# Altium project CH9329.PrjPcb
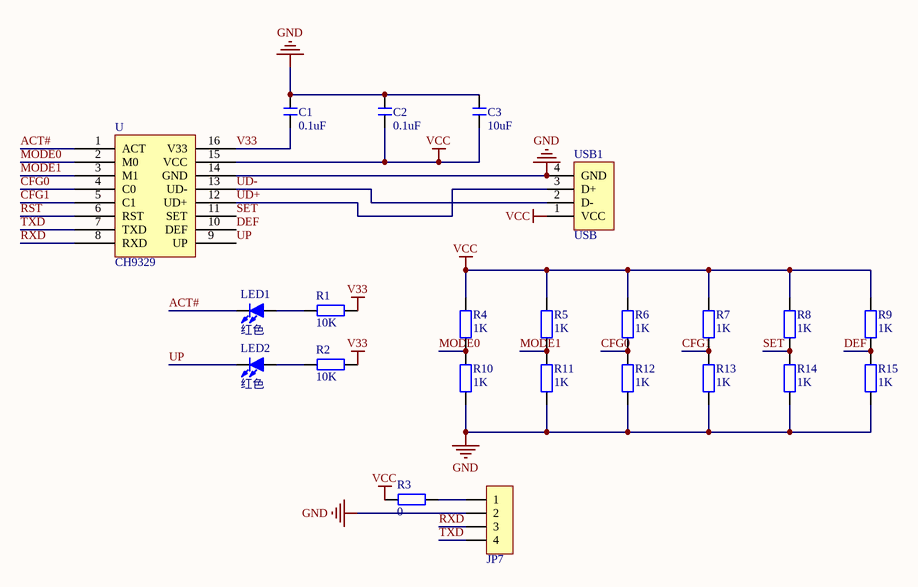
[diagram p0: CH9329.SchDoc]
1 sheet, 23 parts. Net scope: global (net labels, ports and power ports of the same name join across sheets).
Board file: CH9329.PcbDoc

## Sheet CH9329.SchDoc
size A4

### Parts
C1  0.1uF  [C 0805_L]
C2  0.1uF  [C 0805_L]
C3  10uF  [C 0805_L]
JP7  HDR-1X4  [HDR2.54-LI-4P]  (value not drawn)
LED1  红色  [LED 0805G]
LED2  红色  [LED 0805G]
R1  10K  [R 0805_L]
R2  10K  [R 0805_L]
R3  0  [R 0805_L]
R4  1K  [R 0603_L]
R5  1K  [R 0603_L]
R6  1K  [R 0603_L]
R7  1K  [R 0603_L]
R8  1K  [R 0603_L]
R9  1K  [R 0603_L]
R10  1K  [R 0603_L]
R11  1K  [R 0603_L]
R12  1K  [R 0603_L]
R13  1K  [R 0603_L]
R14  1K  [R 0603_L]
R15  1K  [R 0603_L]
U  CH9329  [ch9329]
USB1  USB  [USB_A/P_A]

### Nets
GND: C1.1 C2.1 C3.1 JP7.2 R10.1 R11.1 R12.1 R13.1 R14.1 R15.1 U.14(GND) USB1.4(GND)
V33: C1.2 R1.2 R2.2 U.16(V33)
VCC: C2.2 C3.2 R3.1 R4.2 R5.2 R6.2 R7.2 R8.2 R9.2 U.15(VCC) USB1.1(VCC)
ACT#: LED1.2(K) U.1(ACT)
CFG0: R6.1 R12.2 U.4(C0)
CFG1: R7.1 R13.2 U.5(C1)
DEF: R9.1 R15.2 U.10(DEF)
MODE0: R4.1 R10.2 U.2(M0)
MODE1: R5.1 R11.2 U.3(M1)
RST: U.6(RST)
RXD: JP7.3 U.8(RXD)
SET: R8.1 R14.2 U.11(SET)
TXD: JP7.4 U.7(TXD)
UD+: U.12(UD+) USB1.3(D+)
UD-: U.13(UD-) USB1.2(D-)
UP: LED2.2(K) U.9(UP)
NetJP7_1: JP7.1 R3.2
NetLED1_1: LED1.1(A) R1.1
NetLED2_1: LED2.1(A) R2.1

### Library data of the parts
C1-C3 = C: 无极性贴片电容; 版权归属: 源创客; BOM名称: 无极性贴片电容; 学习资源: www.ooocke.com
JP7 = Header 4: 4P接插件; 版权归属: 源创客; BOM名称: 4P接插件; 学习资源: www.ooocke.com
LED1 LED2 = LED-SMD: 贴片LED; 版权归属: 源创客; BOM名称: 贴片LED; 学习资源: www.ooocke.com
R1-R15 = R: 贴片电阻; 版权归属: 源创客; BOM名称: 贴片电阻; 学习资源: www.ooocke.com
USB1 = USB-A/P: USB-A型公接口; 版权归属: 源创客; BOM名称: USB-A型公接口; 学习资源: www.ooocke.com